# Altium schematic sheet 4ch GRT reader v6.SCHDOC
size C
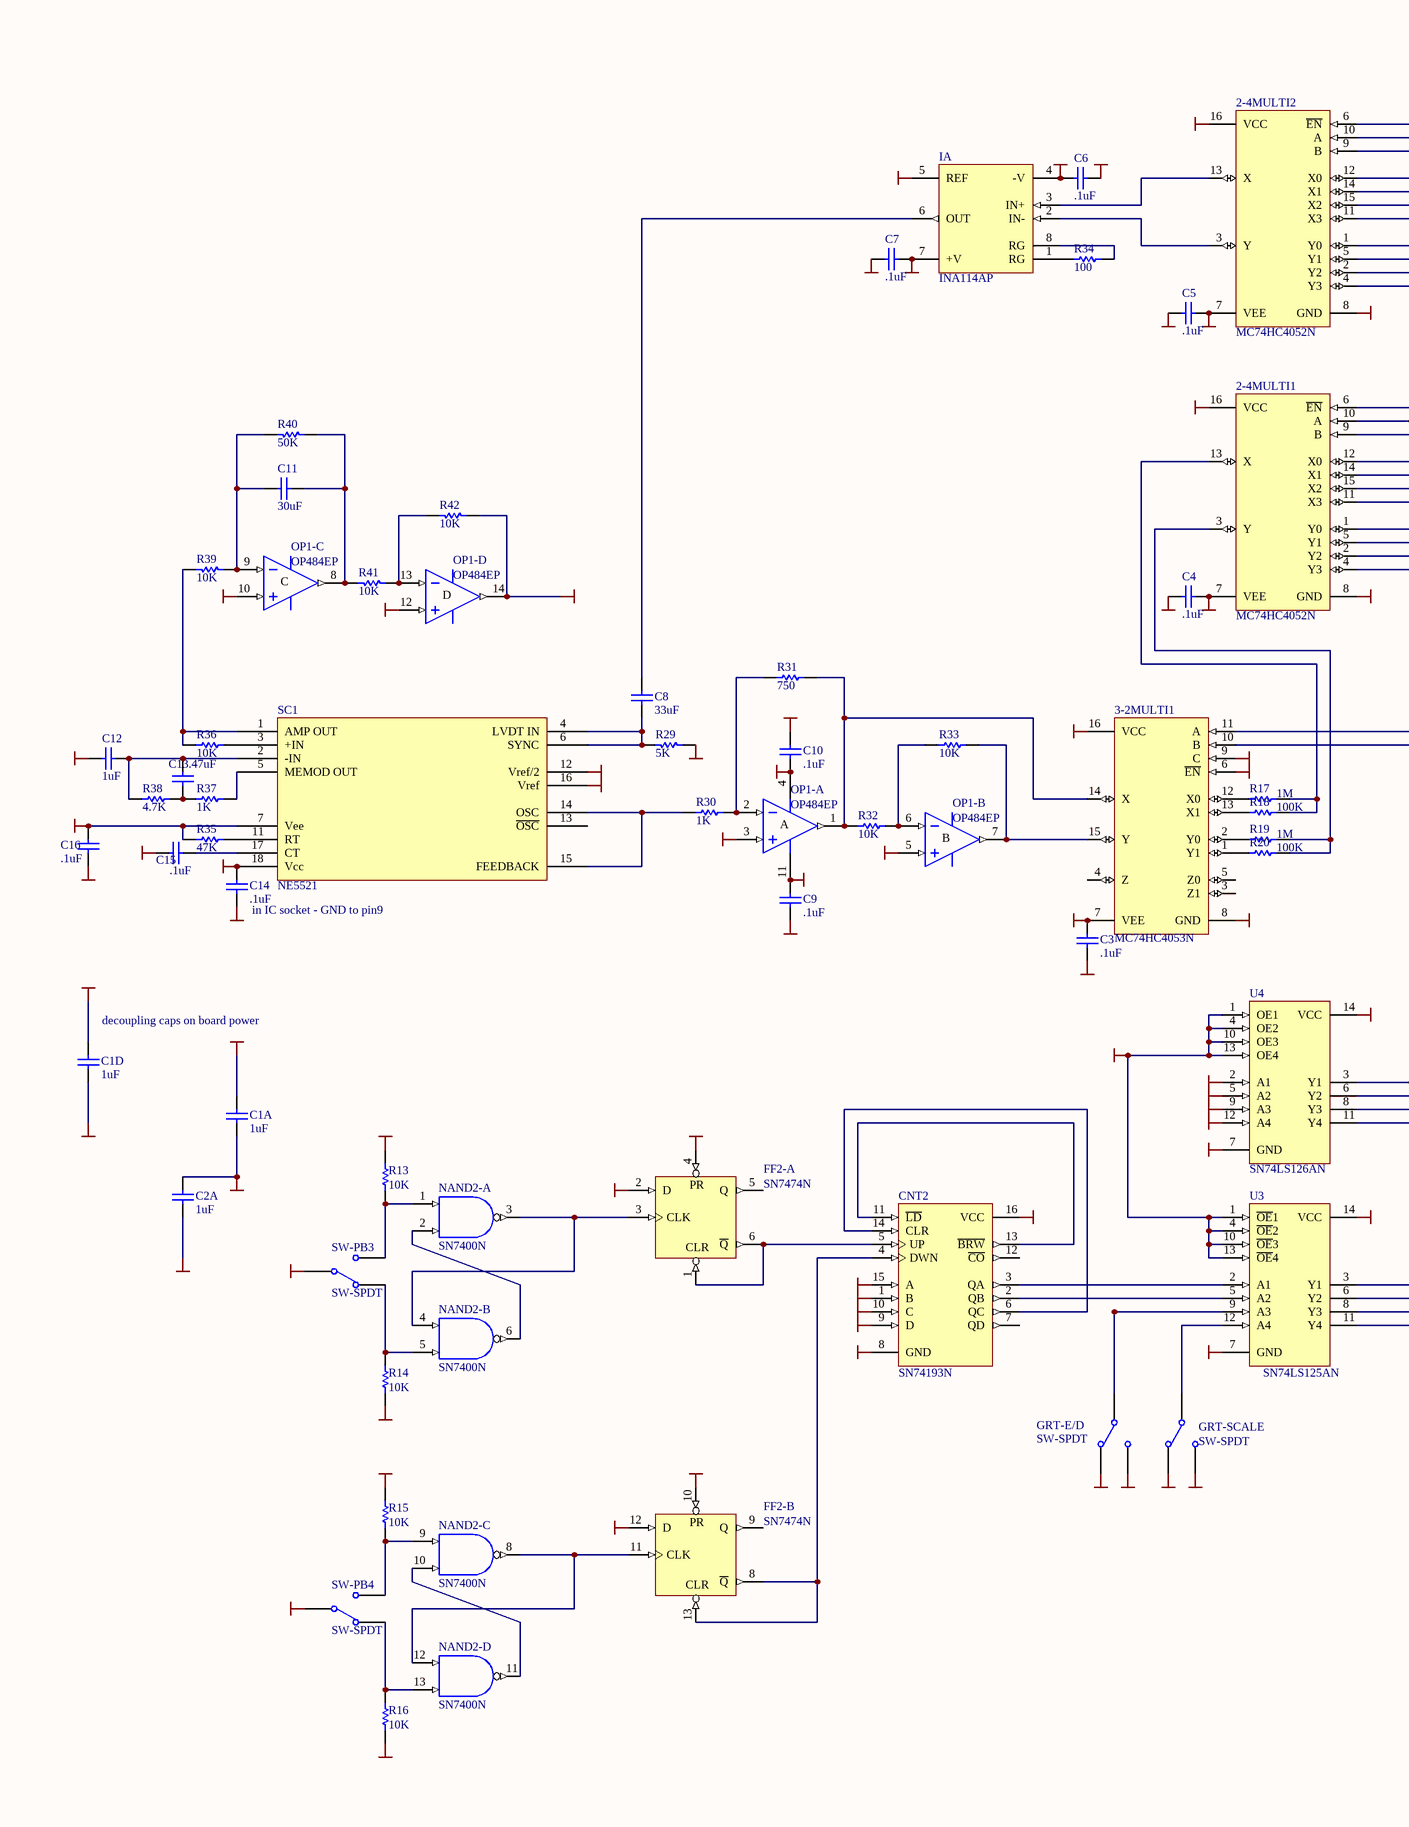
[diagram p0: 4ch GRT reader v6.SCHDOC, left]
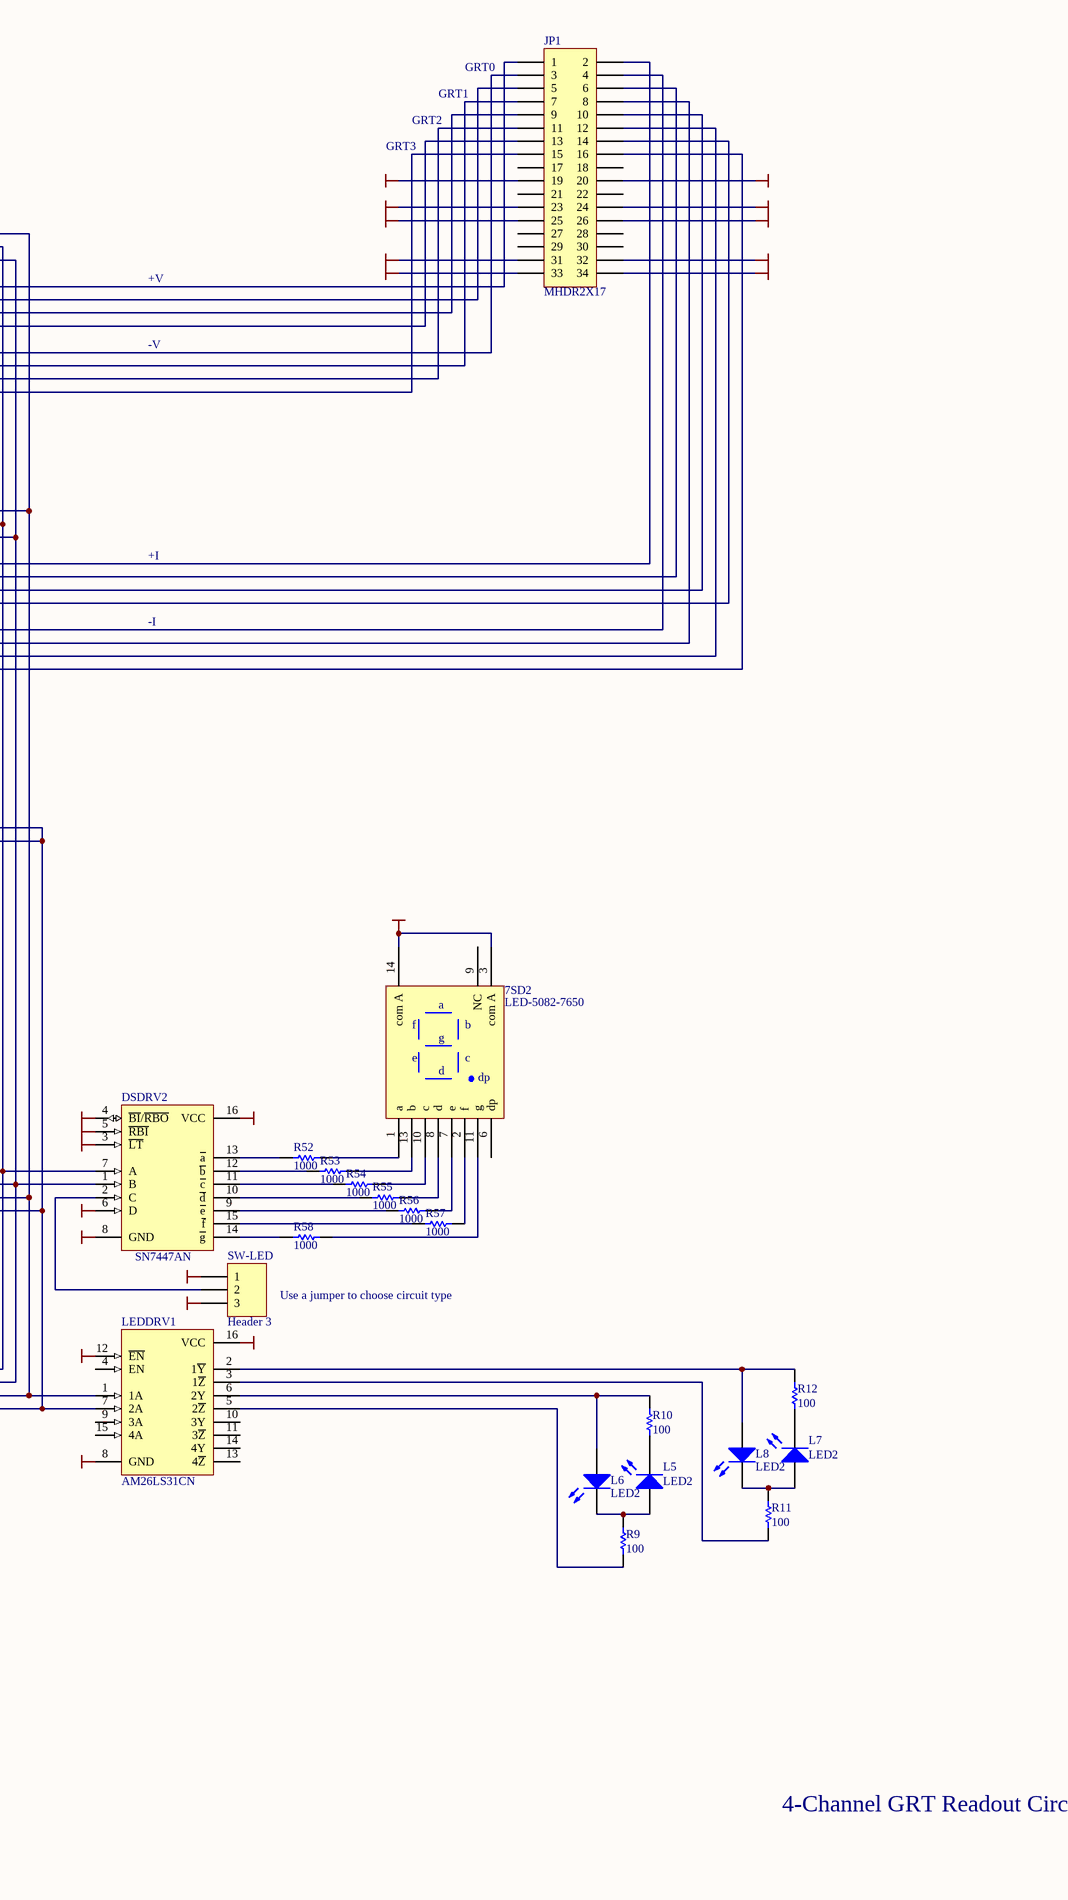
[diagram p1: 4ch GRT reader v6.SCHDOC, right]

## Parts
2-4MULTI1  MC74HC4052N  [DIP-16/X1.5]
2-4MULTI2  MC74HC4052N  [DIP-16/X1.5]
3-2MULTI1  MC74HC4053N  [DIP-16/X1.5]
7SD2  LED-5082-7650  [DIP-14]
C1A  1uF  [RAD-0.2]
C1D  1uF  [RAD-0.2]
C2A  1uF  [RAD-0.2]
C3  .1uF  [RAD-0.1]
C4  .1uF  [RAD-0.1]
C5  .1uF  [RAD-0.1]
C6  .1uF  [RAD-0.1]
C7  .1uF  [RAD-0.1]
C8  33uF  [RAD-0.1]
C9  .1uF  [RAD-0.1]
C10  .1uF  [RAD-0.1]
C11  30uF  [RAD-0.1]
C12  1uF  [RAD-0.1]
C13  .47uF  [RAD-0.1]
C14  in IC socket - GND to pin9  value .1uF  [RAD-0.1]
C15  .1uF  [RAD-0.1]
C16  .1uF  [RAD-0.1]
CNT2  SN74193N  [DIP-16/X1.5]
DSDRV2  SN7447AN  [DIP-16/X1.5]
FF2-  SN7474N  [DIP-14/D19.7]  (parts A,B of 2)
GRT-E/D  SW-SPDT  [SPDT-3]
GRT-SCALE  SW-SPDT  [SPDT-3]
IA  INA114AP  [DIP-8]
JP1  MHDR2X17  [HDR2X17]
L5  LED2  [HDR1X2]
L6  LED2  [HDR1X2]
L7  LED2  [HDR1X2]
L8  LED2  [HDR1X2]
LEDDRV1  AM26LS31CN  [DIP-16/X1.5]
NAND2-  SN7400N  [DIP-14/D19.7]  (parts A,B,C,D of 4)
OP1-  OP484EP  [DIP-14]  (parts A,B,C,D of 4)
R9  100  [AXIAL-0.3]
R10  100  [AXIAL-0.3]
R11  100  [AXIAL-0.3]
R12  100  [AXIAL-0.3]
R13  10K  [AXIAL-0.3]
R14  10K  [AXIAL-0.3]
R15  10K  [AXIAL-0.3]
R16  10K  [AXIAL-0.3]
R17  1M  [AXIAL-0.3]
R18  100K  [AXIAL-0.3]
R19  1M  [AXIAL-0.3]
R20  100K  [AXIAL-0.3]
R29  5K  [AXIAL-0.3]
R30  1K  [AXIAL-0.3]
R31  750  [AXIAL-0.3]
R32  10K  [AXIAL-0.3]
R33  10K  [AXIAL-0.3]
R34  100  [AXIAL-0.3]
R35  47K  [AXIAL-0.3]
R36  10K  [AXIAL-0.3]
R37  1K  [AXIAL-0.3]
R38  4.7K  [AXIAL-0.3]
R39  10K  [AXIAL-0.3]
R40  50K  [AXIAL-0.3]
R41  10K  [AXIAL-0.3]
R42  10K  [AXIAL-0.3]
R52  1000  [AXIAL-0.3]
R53  1000  [AXIAL-0.3]
R54  1000  [AXIAL-0.3]
R55  1000  [AXIAL-0.3]
R56  1000  [AXIAL-0.3]
R57  1000  [AXIAL-0.3]
R58  1000  [AXIAL-0.3]
SC1  NE5521  [DIP-18]
SW-LED  Header 3  [HDR1X3]
SW-PB3  SW-SPDT  [SPDT-3]
SW-PB4  SW-SPDT  [SPDT-3]
U3  SN74LS125AN  [DIP-14/D19.7]
U4  SN74LS126AN  [DIP-14/D19.7]

## Nets
+5AV: 2-4MULTI1.16(VCC) 2-4MULTI2.16(VCC) 3-2MULTI1.16(VCC) C1A.2 C7.2 C10.1 C14.2 IA.7(+V) OP1-.4(V+) SC1.16(Vref) SC1.18(Vcc)
+5DV: 7SD2.3(com_A) 7SD2.14(com_A) C1D.2 CNT2.1(B) CNT2.15(A) CNT2.16(VCC) DSDRV2.3(~{LT}) DSDRV2.4(~{BI}/~{RBO}) DSDRV2.5(~{RBI}) DSDRV2.16(VCC) FF2-.2(D) FF2-.4(PR) FF2-.10(PR) FF2-.12(D) GRT-E/D.2(NC) GRT-SCALE.2(NC) JP1.23 LEDDRV1.16(VCC) R13.2 R14.1 R15.2 R16.1 SW-LED.3 U3.14(VCC) U4.14(VCC)
-5V: 2-4MULTI1.7(VEE) 2-4MULTI2.7(VEE) 3-2MULTI1.7(VEE) C2A.1 C3.1 C4.2 C5.2 C6.1 C9.2 C16.2 IA.4(-V) JP1.24 OP1-.11(V-) R35.2 SC1.7(Vee)
AGD: 2-4MULTI1.8(GND) 2-4MULTI2.8(GND) 3-2MULTI1.6(~{EN}) 3-2MULTI1.8(GND) 3-2MULTI1.9(C) C1A.1 C2A.2 C3.2 C4.1 C5.1 C6.2 C7.1 C9.1 C10.2 C12.1 C14.1 C15.1 C16.1 IA.5(REF) JP1.20 OP1-.3(IN+) OP1-.5(IN+) OP1-.10(IN+) OP1-.12(IN+) R29.2 SC1.12(Vref/2)
DGD: C1D.1 CNT2.8(GND) CNT2.9(D) CNT2.10(C) DSDRV2.6(D) DSDRV2.8(GND) GRT-E/D.3(NO) GRT-SCALE.3(NO) JP1.25 LEDDRV1.8(GND) LEDDRV1.12(~{EN}) SW-LED.1 SW-PB3.1(COMMON) SW-PB4.1(COMMON) U3.7(GND) U4.7(GND)
DIO0: JP1.31 U4.2(A1)
DIO1: JP1.32 U4.5(A2)
DIO2: JP1.33 U4.9(A3)
DIO3: JP1.34 U4.12(A4)
GND: FF2-.7(GND) NAND2-.7(GND)
GRT OUT: JP1.19 OP1-.14(OUT) R42.1
L/R Line: JP1.26 U3.1(~{OE}1) U3.4(~{OE}2) U3.10(~{OE}3) U3.13(~{OE}4) U4.1(OE1) U4.4(OE2) U4.10(OE3) U4.13(OE4)
VCC: FF2-.14(VCC) NAND2-.14(VCC)
Net2-4MULTI1_1: 2-4MULTI1.1(Y0) JP1.4
Net2-4MULTI1_2: 2-4MULTI1.2(Y2) JP1.12
Net2-4MULTI1_3: 2-4MULTI1.3(Y) R19.2 R20.2
Net2-4MULTI1_4: 2-4MULTI1.4(Y3) JP1.16
Net2-4MULTI1_5: 2-4MULTI1.5(Y1) JP1.8
Net2-4MULTI1_6: 2-4MULTI1.6(~{EN}) 2-4MULTI2.6(~{EN}) LEDDRV1.1(1A) U3.8(Y3) U4.8(Y3)
Net2-4MULTI1_9: 2-4MULTI1.9(B) 2-4MULTI2.9(B) DSDRV2.1(B) U3.6(Y2) U4.6(Y2)
Net2-4MULTI1_10: 2-4MULTI1.10(A) 2-4MULTI2.10(A) DSDRV2.7(A) U3.3(Y1) U4.3(Y1)
Net2-4MULTI1_11: 2-4MULTI1.11(X3) JP1.14
Net2-4MULTI1_12: 2-4MULTI1.12(X0) JP1.2
Net2-4MULTI1_13: 2-4MULTI1.13(X) R17.2 R18.2
Net2-4MULTI1_14: 2-4MULTI1.14(X1) JP1.6
Net2-4MULTI1_15: 2-4MULTI1.15(X2) JP1.10
Net2-4MULTI2_1: 2-4MULTI2.1(Y0) JP1.3
Net2-4MULTI2_2: 2-4MULTI2.2(Y2) JP1.11
Net2-4MULTI2_3: 2-4MULTI2.3(Y) IA.2(IN-)
Net2-4MULTI2_4: 2-4MULTI2.4(Y3) JP1.15
Net2-4MULTI2_5: 2-4MULTI2.5(Y1) JP1.7
Net2-4MULTI2_11: 2-4MULTI2.11(X3) JP1.13
Net2-4MULTI2_12: 2-4MULTI2.12(X0) JP1.1
Net2-4MULTI2_13: 2-4MULTI2.13(X) IA.3(IN+)
Net2-4MULTI2_14: 2-4MULTI2.14(X1) JP1.5
Net2-4MULTI2_15: 2-4MULTI2.15(X2) JP1.9
Net3-2MULTI1_1: 3-2MULTI1.1(Y1) R20.1
Net3-2MULTI1_2: 3-2MULTI1.2(Y0) R19.1
Net3-2MULTI1_10: 3-2MULTI1.10(B) 3-2MULTI1.11(A) LEDDRV1.7(2A) U3.11(Y4) U4.11(Y4)
Net3-2MULTI1_12: 3-2MULTI1.12(X0) R17.1
Net3-2MULTI1_13: 3-2MULTI1.13(X1) R18.1
Net3-2MULTI1_14: 3-2MULTI1.14(X) OP1-.1(OUT) R31.2 R32.1
Net3-2MULTI1_15: 3-2MULTI1.15(Y) OP1-.7(OUT) R33.2
Net7SD2_1: 7SD2.1(a) R52.2
Net7SD2_2: 7SD2.2(f) R57.2
Net7SD2_7: 7SD2.7(e) R56.2
Net7SD2_8: 7SD2.8(d) R55.2
Net7SD2_10: 7SD2.10(c) R54.2
Net7SD2_11: 7SD2.11(g) R58.2
Net7SD2_13: 7SD2.13(b) R53.2
NetC8_1: C8.1 R29.1 SC1.4(LVDT_IN) SC1.6(SYNC)
NetC8_2: C8.2 IA.6(OUT)
NetC11_1: C11.1 OP1-.9(IN-) R39.1 R40.2
NetC11_2: C11.2 OP1-.8(OUT) R40.1 R41.2
NetC12_2: C12.2 C13.2 R38.2 SC1.2(-IN)
NetC13_1: C13.1 R37.2 R38.1
NetC15_2: C15.2 SC1.17(CT)
NetCNT2_2: CNT2.2(QB) U3.5(A2)
NetCNT2_3: CNT2.3(QA) U3.2(A1)
NetCNT2_4: CNT2.4(DWN) FF2-.8(~{Q}) FF2-.13(CLR)
NetCNT2_5: CNT2.5(UP) FF2-.1(CLR) FF2-.6(~{Q})
NetCNT2_6: CNT2.6(QC) CNT2.14(CLR)
NetCNT2_11: CNT2.11(~{LD}) CNT2.13(~{BRW})
NetDSDRV2_2: DSDRV2.2(C) SW-LED.2
NetDSDRV2_9: DSDRV2.9(~{e}) R56.1
NetDSDRV2_10: DSDRV2.10(~{d}) R55.1
NetDSDRV2_11: DSDRV2.11(~{c}) R54.1
NetDSDRV2_12: DSDRV2.12(~{b}) R53.1
NetDSDRV2_13: DSDRV2.13(~{a}) R52.1
NetDSDRV2_14: DSDRV2.14(~{g}) R58.1
NetDSDRV2_15: DSDRV2.15(~{f}) R57.1
NetFF2-_3: FF2-.3(CLK) NAND2-.3(Y) NAND2-.4(A)
NetFF2-_11: FF2-.11(CLK) NAND2-.8(Y) NAND2-.12(A)
NetGRT-E/D_1: GRT-E/D.1(COMMON) U3.9(A3)
NetGRT-SCALE_1: GRT-SCALE.1(COMMON) U3.12(A4)
NetIA_1: IA.1(RG) R34.2
NetIA_8: IA.8(RG) R34.1
NetL5_1: L5.1(A) L6.2(K) R9.2
NetL5_2: L5.2(K) R10.1
NetL6_1: L6.1(A) LEDDRV1.6(2Y) R10.2
NetL7_1: L7.1(A) L8.2(K) R11.2
NetL7_2: L7.2(K) R12.1
NetL8_1: L8.1(A) LEDDRV1.2(1~{Y}) R12.2
NetLEDDRV1_3: LEDDRV1.3(1~{Z}) R11.1
NetLEDDRV1_5: LEDDRV1.5(2~{Z}) R9.1
NetNAND2-_1: NAND2-.1(A) R13.1 SW-PB3.3(NO)
NetNAND2-_2: NAND2-.2(B) NAND2-.6(Y)
NetNAND2-_5: NAND2-.5(B) R14.2 SW-PB3.2(NC)
NetNAND2-_9: NAND2-.9(A) R15.1 SW-PB4.3(NO)
NetNAND2-_10: NAND2-.10(B) NAND2-.11(Y)
NetNAND2-_13: NAND2-.13(B) R16.2 SW-PB4.2(NC)
NetOP1-_2: OP1-.2(IN-) R30.2 R31.1
NetOP1-_6: OP1-.6(IN-) R32.2 R33.1
NetOP1-_13: OP1-.13(IN-) R41.1 R42.2
NetR30_1: R30.1 SC1.14(OSC) SC1.15(FEEDBACK)
NetR35_1: R35.1 SC1.11(RT)
NetR36_1: R36.1 SC1.3(+IN)
NetR36_2: R36.2 R39.2 SC1.1(AMP_OUT)
NetR37_1: R37.1 SC1.5(MEMOD_OUT)

Not connected (* = marked no-connect by the designer): 3-2MULTI1 3(Z1) 4(Z) 5(Z0); 7SD2 6(dp) 9(NC); CNT2 7(QD) 12(~{CO}); FF2- 5(Q) 9(Q); JP1 17 18 21 22 27 28 29 30; LEDDRV1 4(EN) 9(3A) 10(3Y) 11(3~{Z}) 13(4~{Z}) 14(4Y) 15(4A); SC1 13(~{OSC})

## Notes on the sheet
- GRT1
- GRT0
- GRT3
- GRT2
- +V
- -V
- +I
- -I
- (near C1D) decoupling caps on board power
- Use a jumper to choose circuit type
- 4-Channel GRT Readout Circuit
- (in symbol OP484EP, part A) A
- (in symbol OP484EP, part B) B
- (in symbol OP484EP, part C) C
- (in symbol OP484EP, part D) D

## Library data of the parts
2-4MULTI1 2-4MULTI2 = MC74HC4052N: Dual 4-Channel Analog Multiplexer/Demultiplexer; Manufacturer: ON Semiconductor; Class I: Logic; Class II: Multiplexer/Encoder/Selector; Published: 15-Apr-2002; Package Reference: 648-08; Publisher: Altium Limited
3-2MULTI1 = MC74HC4053N: Analog Multiplexer/Demultiplexer; Manufacturer: ON Semiconductor; Class I: Logic; Class II: Multiplexer/Encoder/Selector; Published: 15-Apr-2002; Package Reference: 648-08; Publisher: Altium Limited
C1A C1D C2A C3-C16 = Cap: Capacitor; Manufacturer: Generic Components; Class I: Passive; Published: 8-Jun-2000; Revision: July-2002: Re-released for DXP Platform.; Publisher: Altium Limited; Class II: Capacitor
  C1A C1D C2A C12: Value: 1uF
  C3-C7 C9 C10 C15 C16: Value: .1uF
  C8: Value: 33uF
  C11: Value: 30uF
  C13: Value: .47uF
CNT2 = SN74193N: Synchronous 4-Bit Up/Down Counter (Dual Clock with Clear); Manufacturer: Texas Instruments; Class I: Logic; Published: 8-Jun-2000; Revision: July-2002: Re-released for DXP Platform.; Datasheet: 1988 TTL Logic Data Book (Mar-1988); Package Reference: N016D; Publisher: Altium Limited; Class II: Counter
DSDRV2 = SN7447AN: BCD-to-Seven-Segment Decoder/Driver; Manufacturer: Texas Instruments; Class I: Interface; Class II: Display Driver; Published: 8-Jun-2000; Revision: July-2002: Re-released for DXP Platform.; Datasheet: Latest Revision: Mar-1988; Package Reference: N016; Publisher: Altium Limited
FF2- = SN7474N: Dual D-Type Positive-Edge-Triggered Flip-Flop with Preset and Clear; Manufacturer: Texas Instruments; Class I: Logic; Published: 8-Jun-2000; Revision: July-2002: Re-released for DXP Platform.; Datasheet: Latest Revision: Mar-1988; Package Reference: N014; Publisher: Altium Limited; Class II: Flip-Flop
GRT-E/D GRT-SCALE SW-PB3 SW-PB4 = SW-SPDT: Single-Pole, Double-Throw Switch; Manufacturer: Generic Components; Published: 24-Mar-1999; Revision: July-2002: Re-released for DXP Platform.; Publisher: Altium Limited
IA = INA114AP: Precision Instrumentation Amplifier; Manufacturer: Burr-Brown; Revision 1: 10-July-2000: SIM Model Added.; Revision 2: July-2002: Re-released for DXP Platform.; Published: 8-Jun-2000; Datasheet: Latest Revision: Mar-1998; Package Reference: 006E; Publisher: Altium Limited; Class I: Amplifier; Class II: Instrumentation Amplifier
JP1 = MHDR2X17: Header, 17-Pin, Dual row; Manufacturer: Generic Components; Class I: Connector; Revision: July-2002: Re-released for DXP Platform.; Publisher: Altium Limited
L5-L8 = LED2: Typical RED, GREEN, YELLOW, AMBER GaAs LED; Manufacturer: Generic Components; Class I: Optoelectronic; Published: 8-Jun-2000; Revision: July-2002: Re-released for DXP Platform.; Publisher: Altium Limited; Class II: LED
LEDDRV1 = AM26LS31CN: Quadruple Differential Line Driver; Manufacturer: Texas Instruments; Class I: Interface; Published: 15-May-2002; Datasheet: 1991 Interface Circuits Data Book (May-1990); Package Reference: N016; Publisher: Altium Limited; Class II: Line Driver
NAND2- = SN7400N: Quadruple 2-Input Positive-NAND Gate; Manufacturer: Texas Instruments; Class I: Logic; Published: 8-Jun-2000; Revision: July-2002: Re-released for DXP Platform.; Datasheet: Latest Revision: Mar-1988; Package Reference: N014; Publisher: Altium Limited; Class II: Gate
OP1- = OP484EP: Precision Rail-to-Rail Input and Output Operational Amplifier; Manufacturer: Analog Devices; Published: 8-Jun-2000; Revision: July-2002: Re-released for DXP Platform.; Datasheet: Designer's Reference Manual CD (REV. 0 1996); Package Reference: N-14; Publisher: Altium Limited; Class I: Amplifier; Class II: Operational Amplifier
R9-R20 R29-R42 R52-R58 = Res1: Resistor; Manufacturer: Generic Components; Class I: Passive; Published: 8-Jun-2000; Revision: July-2002: Re-released for DXP Platform.; Publisher: Altium Limited; Class II: Resistor
  R9-R12 R34: Value: 100
  R13-R16 R32 R33 R36 R39 R41 R42: Value: 10K
  R17 R19: Value: 1M
  R18 R20: Value: 100K
  R29: Value: 5K
  R30 R37: Value: 1K
  R31: Value: 750
  R35: Value: 47K
  R38: Value: 4.7K
  R40: Value: 50K
  R52-R58: Value: 1000
SW-LED = Header 3: Header, 3-Pin; Manufacturer: Generic Components; Class I: Connector; Revision: July-2002: Re-released for DXP Platform.; Publisher: Altium Limited
U3 = SN74LS125AN: Quadruple Bus Buffer with 3-State Outputs; Manufacturer: Texas Instruments; Revision 1: 12-July-2000: SIM Model Added.; Revision 2: July-2002: Re-released for DXP Platform.; Class I: Logic; Class II: Buffer/Line Driver; Published: 8-Jun-2000; Datasheet: Latest Revision: Mar-1988; Package Reference: N014; Publisher: Altium Limited
U4 = SN74LS126AN: Quadruple Bus Buffer with 3-State Outputs; Manufacturer: Texas Instruments; Revision 1: 12-July-2000: SIM Model Added.; Revision 2: July-2002: Re-released for DXP Platform.; Class I: Logic; Class II: Buffer/Line Driver; Published: 8-Jun-2000; Datasheet: Latest Revision: Mar-1988; Package Reference: N014; Publisher: Altium Limited